# Altium schematic sheet Sensing_Phase1.SchDoc
size B
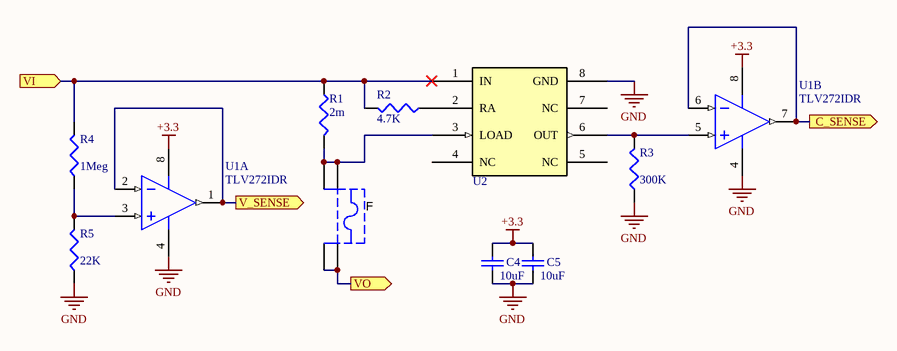
[diagram p0: Sensing_Phase1.SchDoc]

## Parts
C4  value 10uF  [1608[0603]]  (hidden comment: Cap Semi)
C5  value 10uF  [1608[0603]]  (hidden comment: Cap Semi)
F  3568  [KSTN-3568_V]  (value not drawn)
R1  value 2m  [Res_2512]  (hidden comment: Res2512)
R2  value 4.7K  [J1-0603]  (hidden comment: Res3)
R3  value 300K  [J1-0603]  (hidden comment: Res3)
R4  value 1Meg  [J1-0603]  (hidden comment: Res3)
R5  value 22K  [J1-0603]  (hidden comment: Res3)
U1  TLV272IDR  [D0008A_N]  (parts A,B of 2)
U2  HV7802  [HV7802]  (value not drawn)

## Ports
C_SENSE (out), V_SENSE (out), VI (in), VO (out)

## Nets
+3.3: C4.1 C5.1 U1.8(VDD)
GND: C4.2 C5.2 R3.1 R5.1 U1.4(GND) U2.8(GND)
C_SENSE: U1.6(IN2-) U1.7(OUT2) ; port C_SENSE
V_SENSE: U1.1(OUT1) U1.2(IN1-) ; port V_SENSE
VI: R1.1 R2.2 R4.2 U2.1(IN) ; port VI
VO: F.3 F.4 ; port VO
NetF_1: F.1 F.2 R1.2 U2.3(LOAD)
NetR2_1: R2.1 U2.2(RA)
NetR3_2: R3.2 U1.5(IN2+) U2.6(OUT)
NetR4_1: R4.1 R5.2 U1.3(IN1+)

Not connected (* = marked no-connect by the designer): U2 4(NC) 5(NC) 7(NC)

## Notes on the sheet
- Title
- Date:
- Revision:
- Number:
- Team Skytanic
- Sheet
- of
- Senior Design
- 2019/2020
- File:

## Library data of the parts
C4 C5 = Cap Semi: Capacitor (Semiconductor SIM Model); Published: 8-Jun-2000; LatestRevisionDate: 29-May-2009; LatestRevisionNote: IPC-7351 Footprint Added.; PackageReference: C1206; Publisher: Altium Limited; PackageDescription: Chip Capacitor
F = CMP-2000-05464-1: Fuse Holder, 20 A, 500 V, -50 to 145 degC, 4-Pin THD, RoHS; Manufacturer: Keystone; Package Reference: 3568; Datasheet Version: 04/2013; Datasheet URL: https://datasheet.ciiva.com/16294/m60-2p40-16294706.pdf; Manufacturer URL: http://www.keyelco.com/; Mounting Technology: ThroughHole; Package Description: 4-Pin Through Hole Device, Body 16 x 6.73 mm, Pitch 9.9 mm
R1 = Res2512: Resistor; Published: 8-Jun-2000; LatestRevisionDate: 29-May-2009; LatestRevisionNote: IPC-7351 Footprint Added.; PackageReference: J1-0603; Publisher: Altium Limited; PackageDescription: Chip Resistor
R2-R5 = Res3: Resistor; Published: 8-Jun-2000; LatestRevisionDate: 29-May-2009; LatestRevisionNote: IPC-7351 Footprint Added.; PackageReference: J1-0603; Publisher: Altium Limited; PackageDescription: Chip Resistor
U1 = CMP-0272-02013-3: 550 uA/Ch, 3 MHz, Rail-to-Rail Output Operational Amplifier, 2.7 to 16 V, -40 to 125 degC, 8-pin SOIC (D8), Green (RoHS & no Sb/Br); Manufacturer: Texas Instruments; Number of Channels: 2; Total Supply Voltage(Min)(+5V is 5, +/-5V is 10): 2.7; Vio (25C)(Max)(mV): 5; Total Supply Voltage(Max)(+5V is 5, +/-5V is 10): 16; Rating: Catalog; GBW(Typ)(MHz): 2.4; IIB(Max)(pA): 60; Packing: LARGE T&R; Iq per channel(Max)(mA): 0.56; CMRR(Min)(dB): 58; Sub Family: Low Supply Voltage Amplifier (<=2.7V), Precision Amplifier; Slew Rate(Typ)(V/us): 2.1; ComponentLink1Description: Manufacturer URL; PartNumber: TLV272IDR; ComponentLink2URL: http://www.ti.com/lit/ds/symlink/tlv272.pdf; PackageDescription: 8-Pin Plastic Small Outline, Body 4.9 x 3.9 mm, Pitch 1.27 mm; ComponentLink3Description: Package Specification; DatasheetVersion: SLOS351D; ComponentLink1URL: http://www.ti.com/; ComponentLink2Description: Datasheet; PackageVersion: 4040047-3/M, 06/2011; PackageReference: D0008A; Offset Drift(Typ)(uV/C): 2; Eco-Plan: Green (RoHS & no Sb/Br); Code_JEDEC: MS-012; ComponentLink3URL: http://www.ti.com/litv/pdf/msoi002j; Mounting Technology: Surface Mount
U2 = HV7802: High Side Current Monitor / 8V to 450V / Configurable Output; datasheet: http://ww1.microchip.com/downloads/en/DeviceDoc/HV7802%20A062813.pdf